# Altium schematic sheet WIFI_BLE_Option.SchDoc
size A4
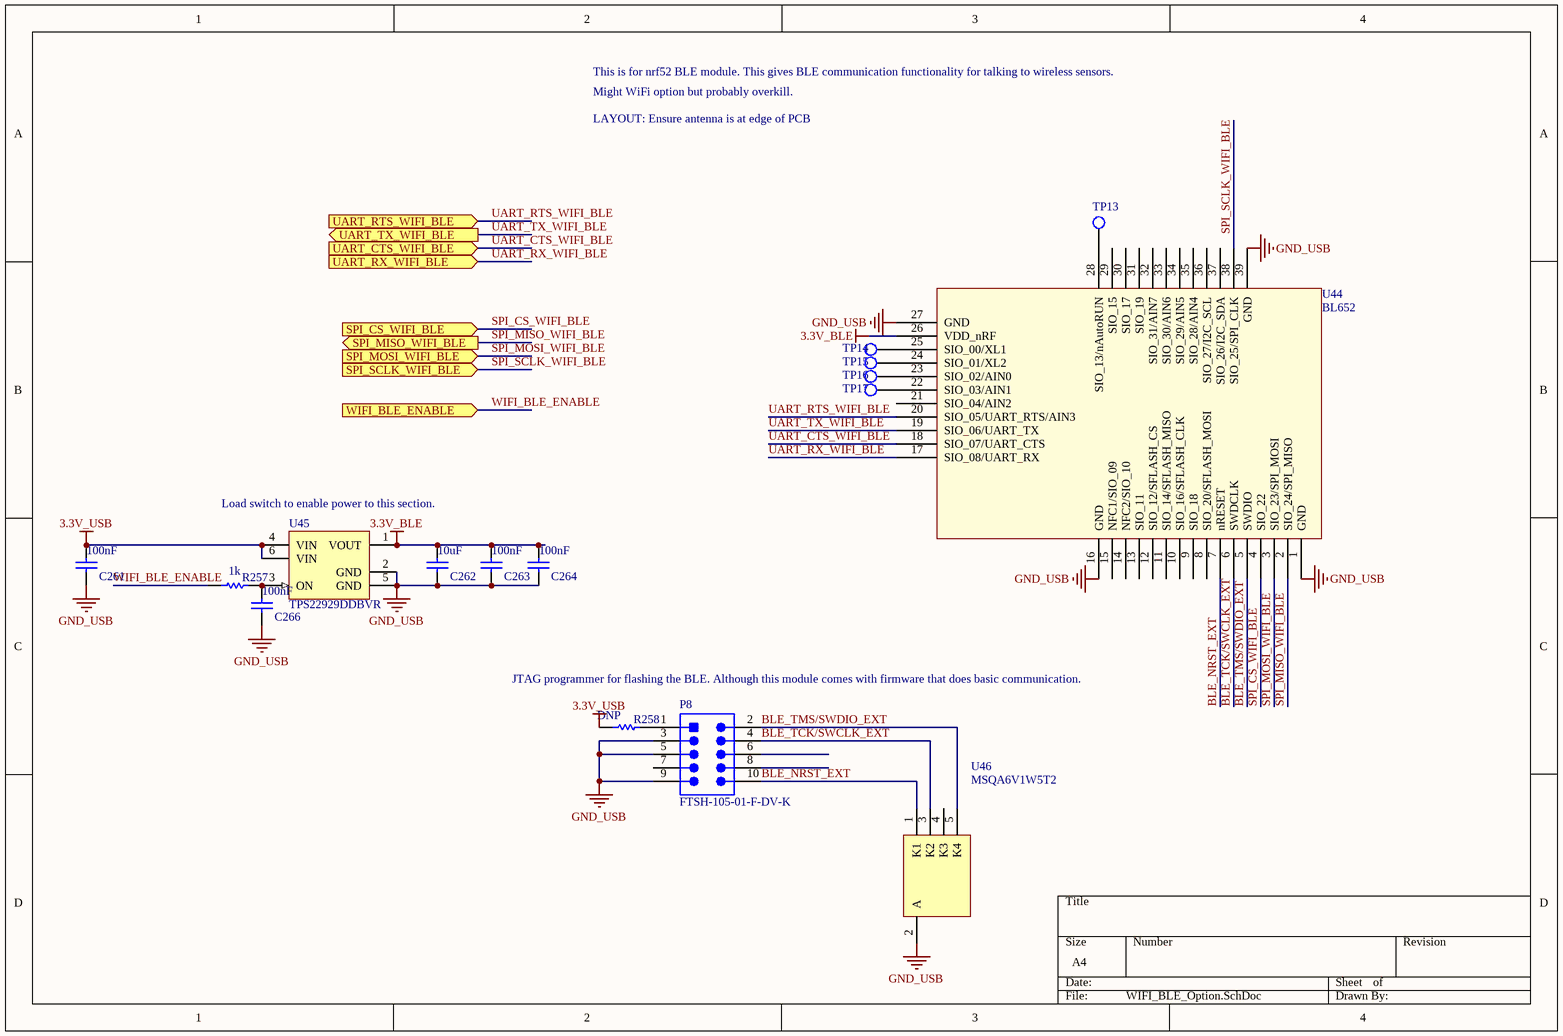
[diagram p0: WIFI_BLE_Option.SchDoc]

## Parts
C261  value 100nF  [CAPC0402(1005)60_L]  (hidden comment: CAP0402)
C262  value 10uF  [CAPC0805(2012)145_L]  (hidden comment: CAP0805)
C263  value 100nF  [CAPC0402(1005)60_L]  (hidden comment: CAP0402)
C264  value 100nF  [CAPC0402(1005)60_L]  (hidden comment: CAP0402)
C266  value 100nF  [CAPC0402(1005)60_L]  (hidden comment: CAP0402)
P8  FTSH-105-01-F-DV-K  [SMTC-FTSH-105-01-L-DV-K_V]
R257  value 1k  [RESC0402(1005)_L]  (hidden comment: RES0402)
R258  value DNP  [RESC0402(1005)_L]  (hidden comment: RES0402)
TP13  Test Point  [Test_Point]  (value not drawn)
TP14  Test Point  [Test_Point]  (value not drawn)
TP15  Test Point  [Test_Point]  (value not drawn)
TP16  Test Point  [Test_Point]  (value not drawn)
TP17  Test Point  [Test_Point]  (value not drawn)
U44  BL652  [BL652]
U45  TPS22929DDBVR  [DBV6_N]
U46  MSQA6V1W5T2  [ONSC-SC70-5-419A-02_V]

## Ports
SPI_CS_WIFI_BLE (in), SPI_MISO_WIFI_BLE (out), SPI_MOSI_WIFI_BLE (in), SPI_SCLK_WIFI_BLE (in), UART_CTS_WIFI_BLE (in), UART_RTS_WIFI_BLE (in), UART_RX_WIFI_BLE (in), UART_TX_WIFI_BLE (out), WIFI_BLE_ENABLE (in)

## Nets
3.3V_BLE: C262.2 C263.1 C264.1 U44.26(VDD_nRF) U45.1(VOUT)
3.3V_USB: C261.1 R258.2 U45.4(VIN) U45.6(VIN)
GND_USB: C261.2 C262.1 C263.2 C264.2 C266.2 P8.3 P8.5 P8.9 U44.1(GND) U44.16(GND) U44.27(GND) U44.39(GND) U45.2(GND) U45.5(GND) U46.2(A)
BLE_NRST_EXT: P8.10 U44.7(nRESET) U46.1(K1)
BLE_TCK/SWCLK_EXT: P8.4 U44.6(SWDCLK) U46.3(K2)
BLE_TMS/SWDIO_EXT: P8.2 U44.5(SWDIO) U46.5(K4)
SPI_CS_WIFI_BLE: U44.4(SIO_22) ; port SPI_CS_WIFI_BLE
SPI_MISO_WIFI_BLE: U44.2(SIO_24/SPI_MISO) ; port SPI_MISO_WIFI_BLE
SPI_MOSI_WIFI_BLE: U44.3(SIO_23/SPI_MOSI) ; port SPI_MOSI_WIFI_BLE
SPI_SCLK_WIFI_BLE: U44.38(SIO_25/SPI_CLK) ; port SPI_SCLK_WIFI_BLE
UART_CTS_WIFI_BLE: U44.18(SIO_07/UART_CTS) ; port UART_CTS_WIFI_BLE
UART_RTS_WIFI_BLE: U44.20(SIO_05/UART_RTS/AIN3) ; port UART_RTS_WIFI_BLE
UART_RX_WIFI_BLE: U44.17(SIO_08/UART_RX) ; port UART_RX_WIFI_BLE
UART_TX_WIFI_BLE: U44.19(SIO_06/UART_TX) ; port UART_TX_WIFI_BLE
WIFI_BLE_ENABLE: R257.2 ; port WIFI_BLE_ENABLE
NetC266_1: C266.1 R257.1 U45.3(ON)
NetP8_1: P8.1 R258.1
NetTP13_1: TP13.1(TP) U44.28(SIO_13/nAutoRUN)
NetTP14_1: TP14.1(TP) U44.25(SIO_00/XL1)
NetTP15_1: TP15.1(TP) U44.24(SIO_01/XL2)
NetTP16_1: TP16.1(TP) U44.23(SIO_02/AIN0)
NetTP17_1: TP17.1(TP) U44.22(SIO_03/AIN1)

Not connected (* = marked no-connect by the designer): P8 6 7 8; U44 8(SIO_20/SFLASH_MOSI) 9(SIO_18) 10(SIO_16/SFLASH_CLK) 11(SIO_14/SFLASH_MISO) 12(SIO_12/SFLASH_CS) 13(SIO_11) 14(NFC2/SIO_10) 15(NFC1/SIO_09) 21(SIO_04/AIN2) 29(SIO_15) 30(SIO_17) 31(SIO_19) 32(SIO_31/AIN7) 33(SIO_30/AIN6) 34(SIO_29/AIN5) 35(SIO_28/AIN4) 36(SIO_27/I2C_SCL) 37(SIO_26/I2C_SDA); U46 4(K3)

## Notes on the sheet
- This is for nrf52 BLE module. This gives BLE communication functionality for talking to wireless sensors.
- Might WiFi option but probably overkill.
- LAYOUT: Ensure antenna is at edge of PCB
- Load switch to enable power to this section.
- JTAG programmer for flashing the BLE. Although this module comes with firmware that does basic communication.

## Library data of the parts
C261 C263 C264 C266 = CMP-1590-00004-1: 0402 (1005 Metric) Chip Capacitor; Case-EIA: 0402; Case-Metric: 1005; PackageReference: CAPC0402(1005)60
C262 = CMP-1590-00003-1: 0805 (2012 Metric) Chip Capacitor; Case-EIA: 0805; Case-Metric: 2012; PackageReference: CAPC0805(2012)145
P8 = CMP-2000-05352-1: Male Header, Pitch 1.27 mm, 2 x 5 Position, Height 6.12 mm, RoHS, Tube; Manufacturer: Samtec; Number of Positions: 10; Connector Type: Header,Shrouded; Number of Positions Loaded: All; Row Spacing: 0.050"(1.27mm); Fastening Type: -; Package Reference: FTSH-105-01-L-DV-K; Termination: Solder; Package URL: http://suddendocs.samtec.com/prints/ftsh-1xx-xx-xxx-dv-xxx-footprint.pdf; Number of Rows: 2; Contact Finish Thickness: 3µin(0.08µm); Contact Type: MalePin; Manufacturer URL: http://www.samtec.com/; Contact Mating Length: 0.120"(3.05mm); Pitch: 0.050"(1.27mm); Series: FTSH; Features: -; Contact Finish: Gold; Color: Black; Family: RectangularConnectors-Headers,MalePins; Datasheet URL: http://suddendocs.samtec.com/prints/ftsh-1xx-xx-xxx-dv-xxx-mkt.pdf; Package Description: Male Header, Pitch 1.27 mm, 2 x 5 Position, Height 5.97 mm, Tail Length 4.32 mm; Mounting Type: SurfaceMount; Datasheet Version: Rev. ET, 10/1995; Category: Connectors,Interconnects; Packaging: Tube
R257 R258 = CMP-1591-00004-1: 0402 (1005 Metric) Chip Resistor; Case-EIA: 0402; Case-Metric: 1005; PackageReference: RESC0402(1005)
TP13-TP17 = Test_Point: HARWIN  S1751-46R  PCB Test Point, S1751 Series, Surface Mount, Copper Alloy, Tin Plated Contacts; Unit Cost: 0.129; ComponentLnkURL1: http://ie.farnell.com/harwin/s1751-46r/test-point-pcb-smt/dp/2293786?ost=2293786&selectedCategoryId=&categoryNameResp=All%2BCategories&searchView=table&iscrfnonsku=false; Manufacturer: HARWIN; Manufacturer Part Number: S1751-46R; Supplier 1: Farnell; Supplier Part Number 1: 2293786; Value: *
U44 = BL652: Manufacturer: Laird - Wireless & Thermal Systems; Manufacturer Part Number: BL652-SA-01-T/R; Utilized IC / Part: nRF52832; RF Family/Standard: Bluetooth; Protocol: Bluetooth v4.2; Frequency: 2.4GHz; Data Rate: 1Mbps; Power - Output: 4dBm; Sensitivity: -96dBm; Serial Interfaces: I²C, SPI, UART; Antenna Type: Integrated, Chip; Memory Size: 512kB Flash, 64kB RAM; Voltage - Supply: 1.7 V ~ 3.6 V; Current - Receiving: 5.4mA; Current - Transmitting: 5.3mA; Supplier 1: Digi-Key; RoHS: RoHS Compliant; Category: RF/IF and RFID; Stock 1: 12877; Pricing 1: 1=6.04 (EUR); Packaging: Cut Tape (CT); Part Status: Active; Modulation: -; Mounting Type: Surface Mount; Operating Temperature: -40°C ~ 85°C; Package / Case: 39-SMD Module; ComponentLink1URL: http://assets.lairdtech.com/home/brandworld/files/Datasheet%20-%20BL652.pdf; ComponentLink1Description: http://assets.lairdtech.com/home/brandworld/files/Datasheet%20-%20BL652.pdf; Supplier Part Number 1: BL652-SA-01-CT-ND
U45 = CMP-0330-00011-1: Low Input Voltage, 1.8 A Single Channel Load Switch with Controlled Turn-On, 1.8 V Logic Compatible, 1.8 A, 1.4 to 5.5 V, -40 to 85 degC, 6-pin SOT-23 (DBV), Green (RoHS & no Sb/Br); Manufacturer: Texas Instruments; Quick Output Discharge Transistor: Yes; SubFamily: Non Current Limited Load Switch; Iin(nA): 10000; Control Logic: 1.8-V Logic Compatible; HBM ESD(kV): 2; Vin(V): 1.4 - 5.5; Active High Enable: TRUE; Output Rise Time(ÂµS): 4500; Imax(A): 1.8; rON @1.8V(mOhm): 85; PartNumber: TPS22929DDBVR; Eco-Plan: Green (RoHS & no Sb/Br); ComponentLink1Description: Datasheet; DatasheetVersion: SLVSB39; PackageReference: DBV6; PackageVersion: revK, Mar-2006; PackageDescription: 6-Pin Plastic Small-Outline Package, 2.9 x 1.6 mm Body, 0.95 mm Pitch, 2.8 mm Lead Span; ComponentLink1URL: http://www.ti.com/general/docs/lit/getliterature.tsp?genericPartNumber=TPS22929D&fileType=pdf; Code_JEDEC: MO-178-AB*; Mounting Technology: Surface Mount
U46 = CMP-1060-00060-1: Quad Array ESD Protection Diodes with Low Clamping Voltage, 5-Pin SC70, Tape and Reel; Manufacturer: On Semiconductor; P Max (W): 0.385; Packing: Tape and Reel; DatasheetVersion: Rev. 7; ComponentLink2URL: http://www.onsemi.com/pub_link/Collateral/MSQA6V1W5T2-D.PDF; PackageDescription: 5-Pin Small Outline Transistor, Body 2 x 1.25 mm, Pitch 0.65 mm; PackageVersion: Rev. L, 01/2013; ComponentLink1URL: http://www.onsemi.com/; ComponentLink2Description: Datasheet; ComponentLink3Description: Package Specification; Mounting Technology: Surface Mount; ComponentLink1Description: Manufacturer URL; PackageReference: SC70-5-419A-02; PartNumber: MSQA6V1W5T2; ComponentLink3URL: http://www.onsemi.cn/pub_link/Collateral/419A-02.PDF